# EAGLE design efikaVFD (EAGLE 5.11)
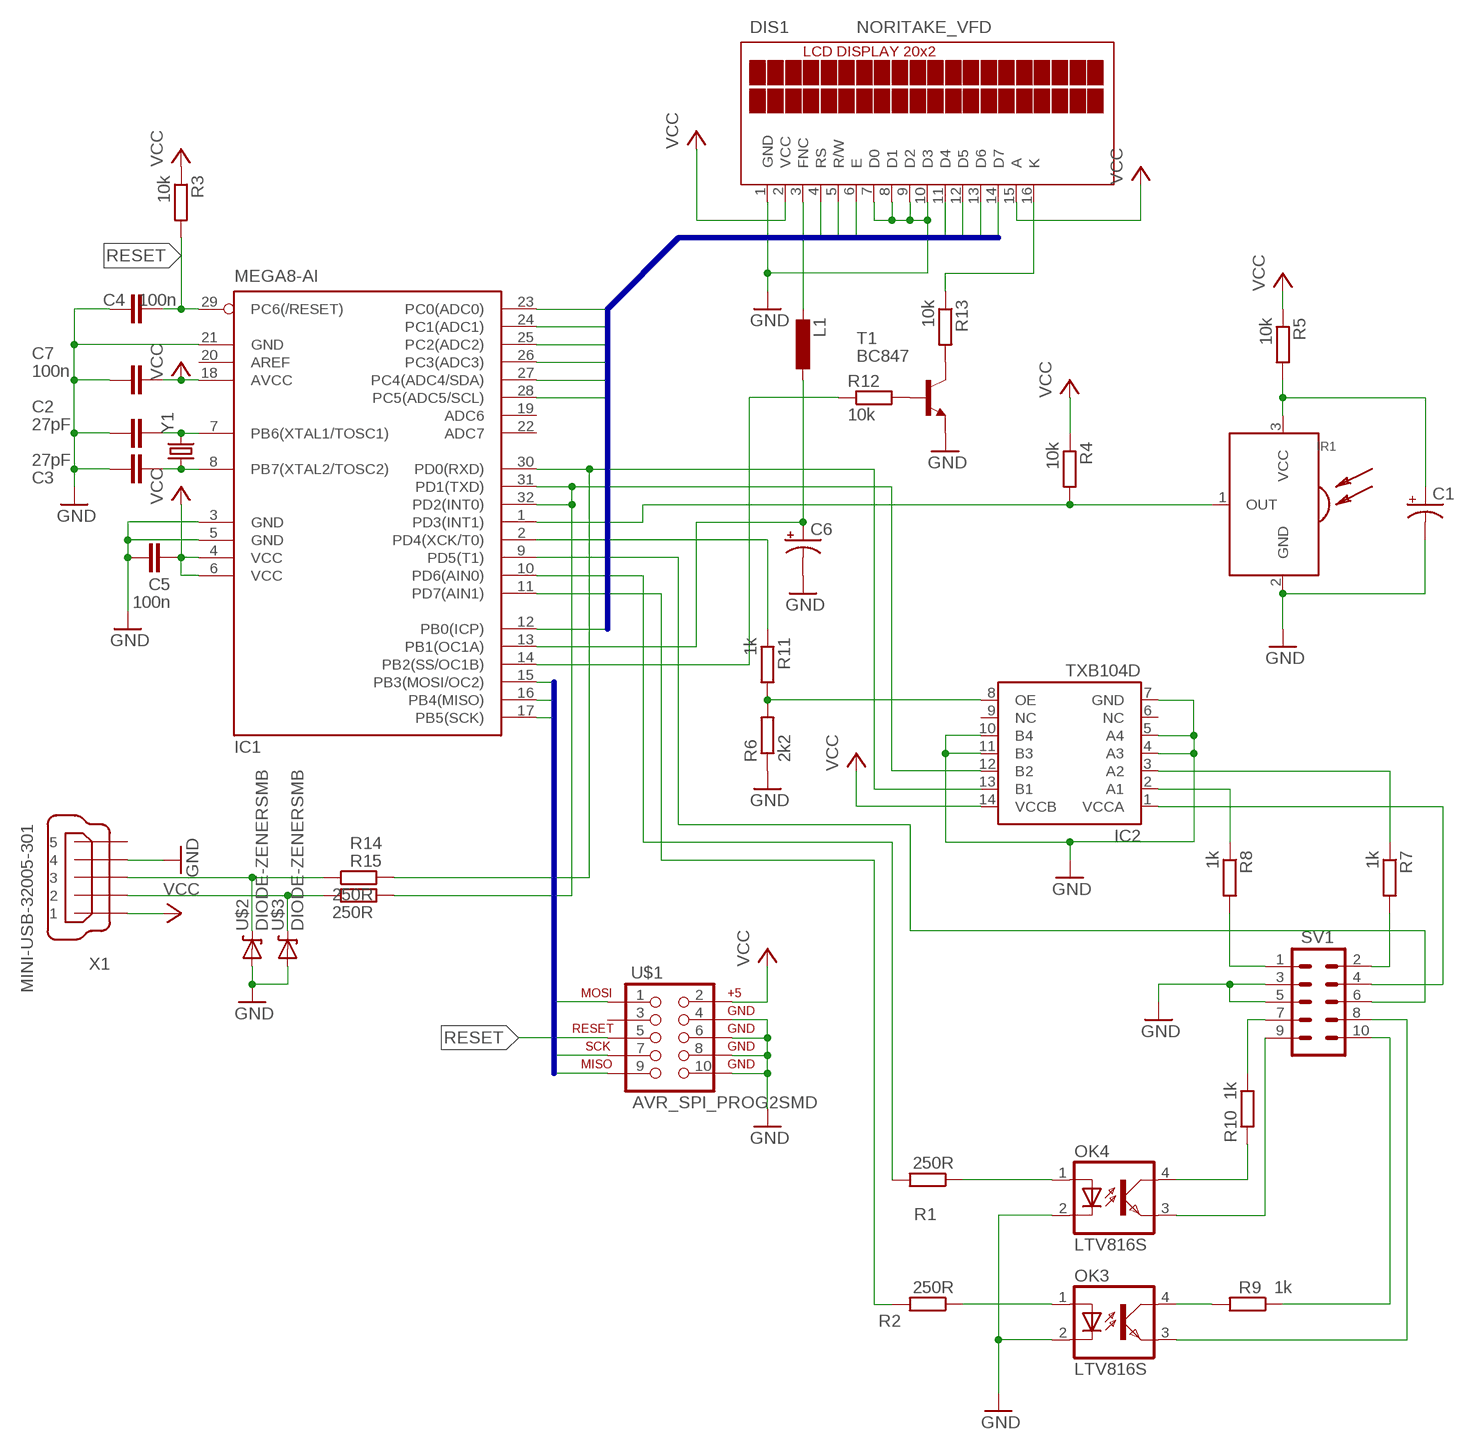
[diagram p0: schematic, sheet 1]

## Parts
C1  CAP_POLPTH2  [CPOL-RADIAL-10UF-25V]
C2  27pF  C-EUC1206  [C1206]
C3  27pF  C-EUC1206  [C1206]
C4  100n  C-EUC1206  [C1206]
C5  100n  C-EUC1206  [C1206]
C6  CAP_POLPTH2  [CPOL-RADIAL-10UF-25V]
C7  100n  C-EUC1206  [C1206]
DIS1  NORITAKE_VFD  [TUXGR_20X2_BOTTOM]
IC1  MEGA8-AI  [TQFP32-08]
IC2  TXB104D  [SOIC(D)-14]
IR1  SFH5110  [SFH511*]
L1  L-EU0204/5  [0204/5]
OK3  LTV816S  [SO04]
OK4  LTV816S  [SO04]
R1  250R  R-EU_M1206  [M1206]
R2  250R  R-EU_M1206  [M1206]
R3  10k  R-EU_M1206  [M1206]
R4  10k  R-EU_M1206  [M1206]
R5  10k  R-EU_M1206  [M1206]
R6  2k2  R-EU_M1206  [M1206]
R7  1k  R-EU_M1206  [M1206]
R8  1k  R-EU_M1206  [M1206]
R9  1k  R-EU_M1206  [M1206]
R10  1k  R-EU_M1206  [M1206]
R11  1k  R-EU_M1206  [M1206]
R12  10k  R-EU_M1206  [M1206]
R13  10k  R-EU_M1206  [M1206]
R14  250R  R-EU_M1206  [M1206]
R15  250R  R-EU_M1206  [M1206]
SV1  M05X2SHD_SMD  [2X5-SHROUDED_SMD]
T1  BC847  [SOT23]
U$1  AVR_SPI_PROG2SMD  [2X5-SHROUDED_SMD]
U$2  DIODE-ZENERSMB  [SMB-DIODE]
U$3  DIODE-ZENERSMB  [SMB-DIODE]
X1  MINI-USB-32005-301  [32005-301]
Y1  CRYSTAL10.5X4.8  [CRYSTAL-SMD-10.5X4.8-2PIN]

## Nets
$N200: C1.1(+) IR1.3(VCC) R5.2
D4: DIS1.11(D4) IC1.25(PC2(ADC2))
D5: DIS1.12(D5) IC1.26(PC3(ADC3))
D6: DIS1.13(D6) IC1.27(PC4(ADC4/SDA))
D7: DIS1.14(D7) IC1.28(PC5(ADC5/SCL))
E: DIS1.6(E) IC1.23(PC0(ADC0))
GND: C1.2(-) C2.1 C3.1 C4.1 C5.1 C6.2(-) C7.1 DIS1.1(GND) DIS1.7(D0) DIS1.8(D1) DIS1.9(D2) DIS1.10(D3) IC1.3(GND) IC1.5(GND) IC1.21(GND) IC2.4(A3) IC2.5(A4) IC2.7(GND) IC2.10(B4) IC2.11(B3) IR1.2(GND) OK3.2(C) OK4.2(C) R6.1 SV1.3 SV1.5 T1.2(E) U$1.4 U$1.6 U$1.8 U$1.10 U$2.A U$3.A X1.4
MISO: IC1.16(PB4(MISO)) U$1.9
MOSI: IC1.15(PB3(MOSI/OC2)) U$1.1
N$1: C2.2 IC1.7(PB6(XTAL1/TOSC1)) Y1.P$2
N$2: C3.2 IC1.8(PB7(XTAL2/TOSC2)) Y1.P$1
N$3: OK4.3(EMIT) SV1.9
N$4: OK3.3(EMIT) SV1.8
N$5: IC1.1(PD3(INT1)) IR1.1(OUT) R4.2
N$6: OK3.1(A) R2.1
N$7: OK4.4(COL) R10.2
N$8: IC1.10(PD6(AIN0)) R1.2
N$9: IC1.11(PD7(AIN1)) R2.2
N$10: R9.1 SV1.10
N$11: OK4.1(A) R1.1
N$12: IC2.2(A1) R8.1
N$13: IC2.3(A2) R7.1
N$14: IC2.1(VCCA) SV1.4
N$15: IC1.2(PD4(XCK/T0)) R11.1
N$16: IC1.9(PD5(T1)) SV1.6
N$17: R7.2 SV1.2
N$18: R8.2 SV1.1
N$19: OK3.4(COL) R9.2
N$20: R10.1 SV1.7
N$21: IC2.8(OE) R6.2 R11.2
N$22: R12.2 T1.1(B)
N$23: R13.2 T1.3(C)
N$24: C6.1(+) IC1.13(PB1(OC1A)) L1.1
N$25: DIS1.3(FNC) L1.2
N$26: IC1.14(PB2(SS/OC1B)) R12.1
N$27: DIS1.16(K) R13.1
N$28: R15.1 U$3.C X1.2
N$29: R14.1 U$2.C X1.3
RESET: C4.2 IC1.29(PC6(/RESET)) R3.2 U$1.5
RS: DIS1.4(RS) IC1.12(PB0(ICP))
RW: DIS1.5(R/W) IC1.24(PC1(ADC1))
RXD: IC1.30(PD0(RXD)) IC2.13(B1) R14.2
SCK: IC1.17(PB5(SCK)) U$1.7
TXD: IC1.31(PD1(TXD)) IC1.32(PD2(INT0)) IC2.12(B2) R15.2
VCC: C5.2 C7.2 DIS1.2(VCC) DIS1.15(A) IC1.4(VCC) IC1.6(VCC) IC1.18(AVCC) IC2.14(VCCB) R3.1 R4.1 R5.1 U$1.2 X1.1
Unconnected: IC1.19(ADC6) IC1.20(AREF) IC1.22(ADC7) IC2.6(NC) IC2.9(NC) U$1.3 X1.5

## Buses
D[0..7],FNC,RS,RW,E
MOSI,SCK,MISO

## Library data of the parts
C1 C6 = SparkFun:CAP_POL: Capacitor Polarized These are standard SMD and PTH capacitors. Normally 10uF, 47uF, and 100uF in electrolytic and tantalum varieties. Always verify the external diameter of the through hole cap, it varies with capacity, voltage, and manufacturer. The EIA devices should be standard.
C2-C5 C7 = rcl:C-EU: CAPACITOR, European symbol
DIS1 = Various:NORITAKE_VFD: Tuxgraphics LCD display 20x2 characters reflective, without background light Source: tuxgr_20x2.pdf; OC_FARNELL: unknown; OC_NEWARK: unknown
IC1 = atmel:MEGA8: MICROCONTROLLER 8 Kbytes FLASH, 1 kbytes SRAM, 512 bytes EEPROM, USART, 6-channel 10 bit ADC, 2-channel 8 bit ADC Pin compatible with Atmega48, ATMega88, ATMega168 Source: avr.lbr; MPN: ATMEGA8-16AU; OC_FARNELL: 9171371; OC_NEWARK: 73M8863
IC2 = ti_txb0104:TXB104
IR1 = svo:SFH511*: SFH 5110 and SFH 5111 are IR receivers to detect light from infrared remote control systems. The IC includes photodiode, preamplifier, automatic gain control, bandpass and demodulator. The black-colored package is designed as daylight- cutoff filter.
L1 = rcl:L-EU: INDUCTOR, European symbol
OK3 OK4 = Various:LTV816: OPTO COUPLER Source: LITEON, LTV816.pdf; OC_FARNELL: unknown; OC_NEWARK: unknown
R1-R15 = resistor:R-EU_: RESISTOR, European symbol
SV1 = SparkFun:M05X2: Header 5x2 Standard 10-pin dual row 0.1" header. Commonly used with AVR-ISP. Use with Spark Fun Electronics SKU: PRT-00778
T1 = transistor:BC847: NPN TRANSISTOR
U$1 = SparkFun:AVR_SPI_PROG2: AVR ICSP Header This is the standard AVR In Circuit Serial Programming header. Minimal, but includes pin one indicator. Works with standard Olimex programmers. Also look for the 6-pin reduced version. Spark Fun Electronics SKU: PRT-00778
U$2 U$3 = SparkFun:DIODE-ZENER: Zener Diode Production Part - 8199 3.4V Zener Voltage
X1 = con-cypressindustries:MINI-USB-: MINI USB-B Conector Source: www.cypressindustries.com; OC_FARNELL: unknown; OC_NEWARK: unknown
Y1 = SparkFun:CRYSTAL: Crystals Various standard crystals. Proven footprints. Spark Fun Electronics SKU : COM-00534

## Board
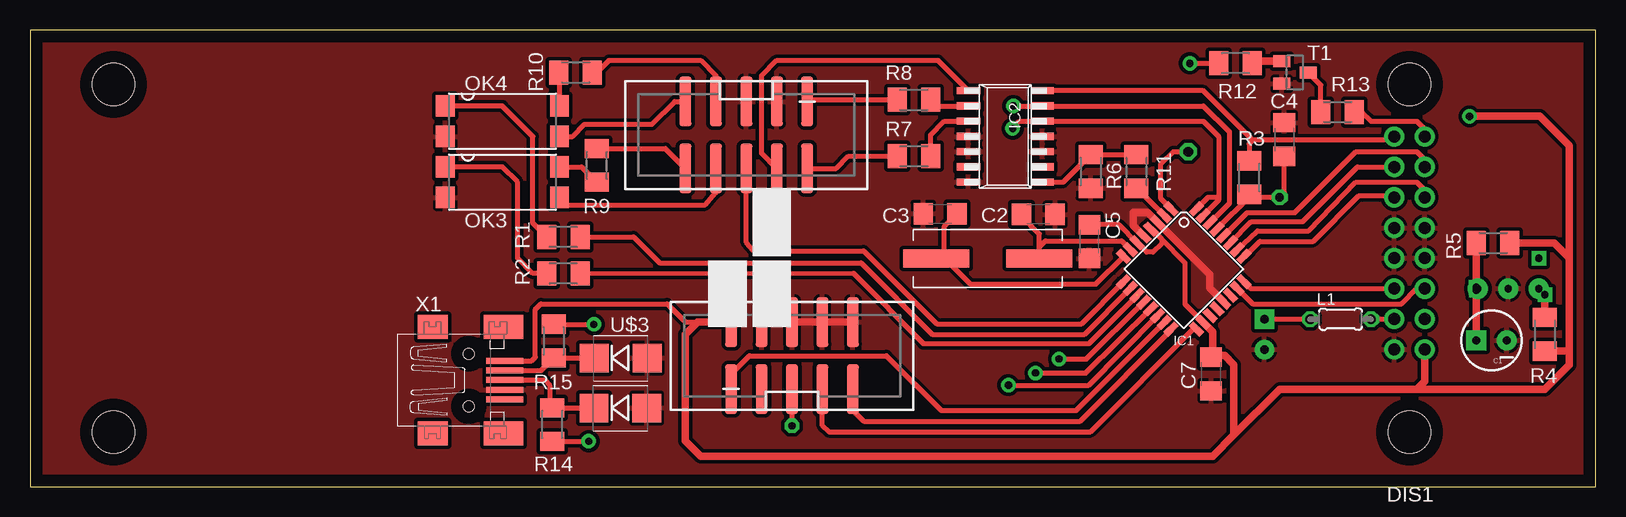
[diagram p1: board, top side]
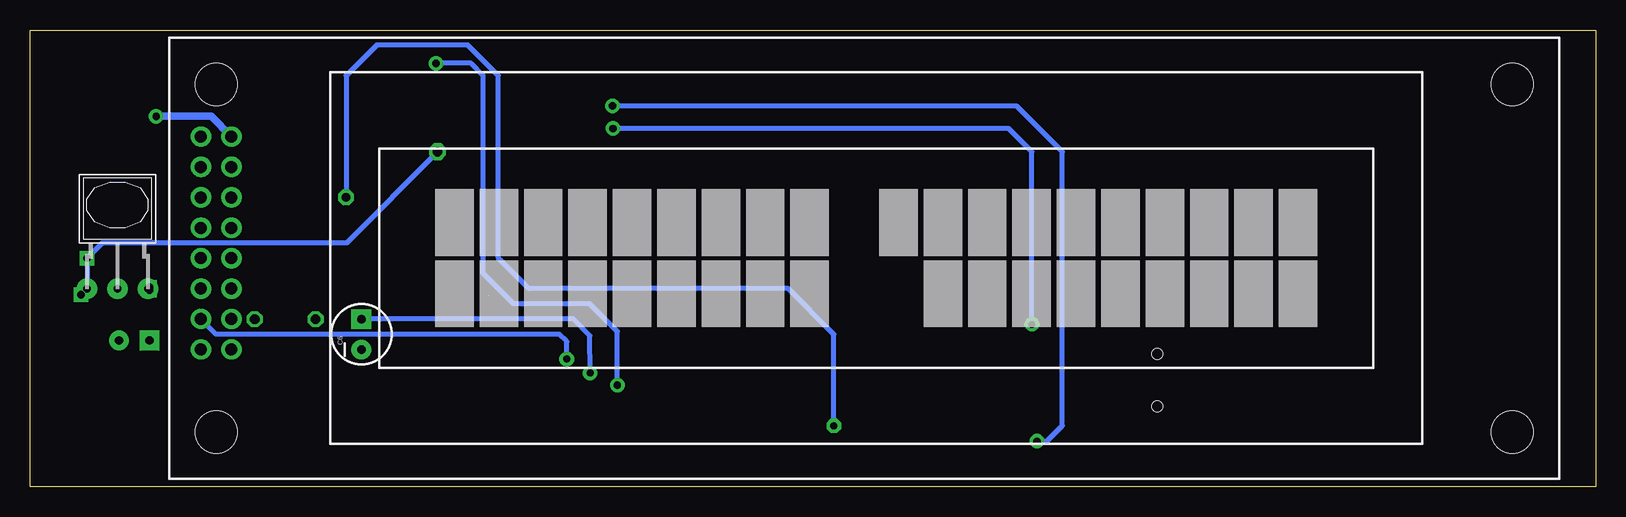
[diagram p2: board, bottom side, seen from below]

Size 130.48 x 38.09 mm. Coordinates in mm from the lower left corner, seen from the top.
Outline: 0,0 130.48,0 130.48,38.09 0,38.09 0,0
Copper layers (1*16): Top 0.035mm / dielectric 1.5mm / Bottom 0.035mm
Design rules "default *": minimum track width 10mil, minimum drill 24mil, track to track 8mil, track to pad 8mil, pad to pad 8mil, via to via 8mil, smd to smd 8mil, copper to edge 40mil, drill to drill 8mil, minimum pad ring 10mil, minimum via ring 12mil, stop-mask expansion 4mil, vias tented up to drill 0mil, thermal gap 10mil

### Footprints (pad centres in the part's own frame; a part is rotated, then mirrored left to right if it is on the bottom)
CPOL-RADIAL-10UF-25V = drill 0.7 pad 1.651 square: 1 1.27,0 | drill 0.7 pad 1.651 round: 2 -1.27,0
C1206 = smd 1.6 x 1.8: 1 -1.4,0; 2 1.4,0
TUXGR_20X2_BOTTOM = drill 1 pad 1.676 round: 1 52.73,-7.62; 2 55.27,-7.62; 3 52.73,-5.08; 4 55.27,-5.08; 5 52.73,-2.54; 6 55.27,-2.54; 7 52.73,0; 8 55.27,0; 9 52.73,2.54; 10 55.27,2.54; 11 52.73,5.08; 12 55.27,5.08; 13 52.73,7.62; 14 55.27,7.62; 15 52.73,10.16; 16 55.27,10.16 | hole 3.5: 54,-14.5; -54,-14.5; 54,14.5; -54,14.5
TQFP32-08 = smd 1.27 x 0.559: 1 -4.293,2.8; 2 -4.293,2; 3 -4.293,1.2; 4 -4.293,0.4; 5 -4.293,-0.4; 6 -4.293,-1.2; 7 -4.293,-2; 8 -4.293,-2.8; 17 4.293,-2.8; 18 4.293,-2; 19 4.293,-1.2; 20 4.293,-0.4; 21 4.293,0.4; 22 4.293,1.2; 23 4.293,2; 24 4.293,2.8 | smd 0.559 x 1.27: 9 -2.8,-4.293; 10 -2,-4.293; 11 -1.2,-4.293; 12 -0.4,-4.293; 13 0.4,-4.293; 14 1.2,-4.293; 15 2,-4.293; 16 2.8,-4.293; 25 2.8,4.293; 26 2,4.293; 27 1.2,4.293; 28 0.4,4.293; 29 -0.4,4.293; 30 -1.2,4.293; 31 -2,4.293; 32 -2.8,4.293
SOIC(D)-14 = smd 0.61 x 1.93: 1 -3.81,-3.076; 2 -2.54,-3.076; 3 -1.27,-3.076; 4 0,-3.076; 5 1.27,-3.076; 6 2.54,-3.076; 7 3.81,-3.076; 8 3.81,3.076; 9 2.54,3.076; 10 1.27,3.076; 11 0,3.076; 12 -1.27,3.076; 13 -2.54,3.076; 14 -3.81,3.076
SFH511* = drill 0.61 pad 1.676 round: 1 -2.54,0; 2 0,0; 3 2.54,0
0204/5 = drill 0.813 octagon: 1 -2.54,0; 2 2.54,0
SO04 = smd 1.78 x 1.55: 1 -1.27,-3.5; 2 1.27,-3.5; 3 1.27,6.04; 4 -1.27,6.04
M1206 = smd 1.6 x 2: 1 -1.4,0; 2 1.4,0
2X5-SHROUDED_SMD = smd 4.15 x 1: 1 -2.794,5.08; 2 2.794,5.08; 3 -2.794,2.54; 4 2.794,2.54; 5 -2.794,0; 6 2.794,0; 7 -2.794,-2.54; 8 2.794,-2.54; 9 -2.794,-5.08; 10 2.794,-5.08
SOT23 = smd 1 x 1.4: 1 -0.95,-1.1; 2 0.95,-1.1; 3 0,1.1
SMB-DIODE = smd 2.4 x 2.4: A 2.2,0; C -2.2,0
32005-301 = smd 3.1 x 0.5: 1 3,1.6; 2 3,0.8; 3 3,0; 4 3,-0.8; 5 3,-1.6 | smd 2.5 x 2: M1 -3,-4.45; M2 -3,4.45 | smd 3.3 x 2: M3 2.9,4.45; M4 2.9,-4.45 | hole 0.9: 0,2.2; 0,-2.2
CRYSTAL-SMD-10.5X4.8-2PIN = smd 5.5 x 1.5: P$1 -4.3,0; P$2 4.3,0

### Placement (x,y rotation side)
C1  121.79,12.19 180 top
C2  84.02,22.71 180 top
C3  75.84,22.76 0 top
C4  104.52,28.96 270 top
C5  88.29,20.45 90 top
C6  102.87,12.7 90 bottom
C7  98.43,9.4 90 top
DIS1  60.96,19.05 0 top
IC1  96.15,18.15 315 top
IC2  81.28,29.21 270 top
IR1  123.19,16.51 0 bottom
L1  109.22,13.97 0 top
OK3  38.1,25.4 270 top
OK4  38.1,30.48 270 top
R1  44.45,20.83 0 top
R2  44.45,17.78 0 top
R3  101.6,25.78 270 top
R4  126.24,12.7 90 top
R5  121.92,20.32 180 top
R6  88.39,26.29 90 top
R7  73.66,27.56 180 top
R8  73.66,32.26 180 top
R9  47.24,26.8 270 top
R10  45.47,34.54 180 top
R11  92.2,26.29 90 top
R12  100.46,35.31 0 top
R13  108.97,31.24 180 top
R14  43.54,5.18 270 top
R15  43.64,12.14 90 top
SV1  59.69,29.34 270 top
T1  105.41,34.54 270 top
U$1  63.5,10.92 90 top
U$2  49.2,6.55 0 top
U$3  49.23,10.72 0 top
X1  36.55,8.89 0 top
Y1  79.81,19.02 0 top

### Tracks (layer width: path | path; a pad name or v marks a point on that pad's centre or on a via)
$N200  (via drill 0.6)
  Top 0.61: C1.1 v120.52,16.38 IR1.3 v120.52,16.64 R5.2
D4
  Top 0.406: IC1.25 101.25,19.21 102.49,20.45 106.93,20.45 110.74,24.26 113.56,24.26 DIS1.11
D5
  Top 0.406: DIS1.12 116.23,24.74 115.57,25.4 110.49,25.4 106.55,21.34 102.29,21.34 IC1.26
D6
  Top 0.406: IC1.27 101.79,22.1 106.05,22.1 110.62,26.67 DIS1.13
D7
  Top 0.406: IC1.28 101.42,22.86 105.41,22.86 110.49,27.94 115.57,27.94 116.23,27.28 DIS1.14
E
  Top 0.406: DIS1.6 115.57,16.51 114.3,15.24 101.89,15.24 IC1.23
GND
  Top 0.61: U$1.10 U$1.8 U$1.6 | U$1.6 63.25,13.97 | U$1.4 U$1.6 | IC1.21 98.3,16.57 98.3,17.7 IC1.3 93.14,22.86 91.95,22.86 91.95,21.79 IC1.5
  pour Top (isolate 0.305): -1.27,39.37 -1.27,0 130.81,0 130.81,39.37
MISO
  Top 0.406: IC1.16 95.09,13.05 87.5,5.46 69.47,5.46 68.58,6.35 U$1.9
MOSI
  Top 0.406: U$1.1 58.42,9.4 59.94,10.92 71.37,10.92 75.95,6.35 87.17,6.35 IC1.15
N$1
  Top 0.406: C2.2 82.55,22.63 84.11,21.08 84.11,20 | 82.55,19.05 82.58,19.02 Y1.P$2 84.11,20 | IC1.7 90.97,20.5 84.61,20.5 84.11,20
N$2
  Top 0.406: IC1.8 88.82,16.89 78.36,16.89 76.2,19.05 | Y1.P$1 76.2,19.05 | C3.2 76.2,21.71 76.2,19.05
N$3
  Top 0.406: SV1.9 53.72,32.13 51.82,30.23 46.23,30.23 45.21,29.21 OK4.3
N$4
  Top 0.406: SV1.8 57.15,24.51 56.26,23.49 44.78,23.49 OK3.3
N$5  (via drill 0.6, 0.8 pad 0.61)
  Top 0.406: v96.52,27.94 95.25,27.94 94.23,26.92 94.23,24.03 IC1.1
  Top 0.61: IR1.1 v126.24,16 R4.2
  Bottom 0.406: v96.52,27.94 100.33,24.13 100.33,24.05 104.06,20.32 124.46,20.32 v125.73,19.05 IR1.1
N$6
  Top 0.406: OK3.1 39.37,26.67 40.64,25.4 40.64,19.05 41.91,17.78 R2.1
N$7
  Top 0.406: OK4.4 44.14,34.47
  Top 0.61: 44.14,34.47 R10.2
N$8  (1 unrouted)
  Top 0.406: R1.2 50.29,20.83 52.48,18.67 69.27,18.67 75.18,12.7 87.88,12.7 91.7,16.51
N$9  (1 unrouted)
  Top 0.406: R2.2 68.61,17.8 74.42,11.94 88.27,11.94 92.26,15.94
N$10
  Top 0.406: 54.48,26.67 SV1.10 52.96,28.2 R9.1
N$11
  Top 0.406: R1.1 41.91,21.97 41.91,29.21 39.37,31.75 OK4.1
N$12
  Top 0.406: IC2.2 75.57,31.75 R8.1
N$13
  Top 0.406: IC2.3 76.2,30.48 75.06,29.34 75.06,27.94 R7.1
N$14
  Top 0.406: 77.72,33.02 IC2.1 75.66,35.56 62.23,35.56 60.96,34.29 60.96,27.81 SV1.4
N$15
  Top 0.406: 94.49,22.6 IC1.2 92.24,24.89 R11.1
N$16
  Top 0.406: SV1.6 59.69,20.37 60.33,19.66 69.47,19.66 75.56,13.59 87.62,13.59 IC1.9
N$17
  Top 0.406: SV1.2 67.18,26.54 68.2,27.56 R7.2
N$18
  Top 0.406: R8.2 64.9,32.26 SV1.1
N$19
  Top 0.406: R9.2 45.97,26.67 OK3.4
N$20
  Top 0.406: SV1.7 57.15,34.29 55.88,35.56 48.26,35.56 47.24,34.54 R10.1
N$21
  Top 0.406: IC2.8 86.1,25.4 R6.2 R11.2
N$22
  Top 0.61: T1.1 102.05,35.49 R12.2
N$23
  Top 0.406: R13.2 107.57,33.49 T1.3
N$24  (via drill 0.6)
  Top 0.406: C6.1 L1.1 | IC1.13 87.99,9.47 v83.8,9.47
  Bottom 0.406: v83.8,9.47 83.82,12.6 85.17,13.97 C6.1
N$25
  Top 0.406: L1.2 DIS1.3
N$26  (via drill 0.6, 0.6 pad 0.61)
  Top 0.406: v96.65,35.31 R12.1 | IC1.14 93.97,14.27 93.97,14.22 93.95,14.22 88.21,8.46 v81.53,8.46
  Bottom 0.406: v81.53,8.46 81.53,12.95 83.82,15.24 90.17,15.24 92.71,17.78 92.71,34.29 93.73,35.31 v96.65,35.31
N$27
  Top 0.406: DIS1.16 116.23,29.82 115.57,30.48 111.76,30.48 111,31.24 R13.1
N$28
  Top 0.406: X1.2 42.59,9.69 R15.1 | 43.66,10.72 U$3.C
  Top 0.61: R15.1 43.66,10.72
N$29
  Top 0.406: X1.3 42.88,8.89 43.31,8.46 43.31,6.81 | 43.38,6.55 U$2.C
  Top 0.61: 43.38,6.55 43.18,6.35 43.3,6.35 R14.1 43.31,6.81
RESET  (via drill 0.6, 0.7 pad 0.41)
  Top 0.406: IC1.29 101.6,24.17 R3.2 101.85,24.13 v104.14,24.13 104.52,24.51 C4.2 | v63.5,5.08 U$1.5
  Bottom 0.406: v63.5,5.08 63.5,12.7 67.31,16.51 88.9,16.51 91.44,19.05 91.44,34.29 93.98,36.83 101.6,36.83 104.14,34.29 v104.14,24.13
RS  (via drill 0.6)
  Top 0.406: 92.83,15.36 IC1.12 92.79,15.4 88.04,10.64 v85.75,10.64
  Bottom 0.406: v85.75,10.64 85.75,12.09 86.36,12.7 114.96,12.7 DIS1.4
RW
  Top 0.406: DIS1.5 101.75,16.51 IC1.24
RXD  (via drill 0.6)
  Top 0.406: IC1.30 98.36,22.04 99.95,23.62 99.95,29.59 97.79,31.75 IC2.13 v81.94,31.75 82.25,31.75 | v46.56,3.78 R14.2
  Bottom 0.406: v81.94,31.75 48.26,31.75 44.45,27.94 44.45,5.08 45.72,3.81 46.53,3.81 v46.56,3.78
SCK
  Top 0.406: IC1.17 96.96,13.14 88.39,4.57 66.55,4.57 66.04,5.08 U$1.7
TXD  (via drill 0.6)
  Top 0.406: IC1.31 99.06,23.89 99.06,24.13 | 99.06,24.13 99.06,29.21 97.79,30.48 IC2.12 82.45,30.48 v81.89,29.87 | IC1.32 98.17,24.13 99.06,24.13 | v46.99,13.54 R15.2
  Bottom 0.406: v81.89,29.87 48.92,29.87 46.99,27.94 v46.99,13.54
VCC  (via drill 0.6)
  Top 0.406: IC1.18 97.8,13.7 | R4.1 126.24,11.43 | R5.1 123.19,20.45 | IC1.4 93.47,21.47 94.3,20.64 | 94.3,20.64 96.27,18.67 96.27,15.2 98.15,13.32 | C5.2 90.76,21.85 IC1.6 93.05,19.56 93.6,19.56 94.3,20.26 94.3,20.64 | 55.63,13.72 54.61,13.72 53.09,15.24 42.57,15.24 42.11,14.78 42.11,10.79 41.81,10.49 X1.1 | IC2.14 97.79,33.02 101.91,28.91 | 101.91,28.91 113.38,28.91 DIS1.15 | 101.91,28.91 101.6,28.6 R3.1
  Top 0.61: 126.11,11.43 R4.1 128.14,11.3 128.27,11.43 | IC1.18 98.15,13.32 98.55,12.92 98.55,10.92 | U$1.2 55.63,13.72 54.61,12.7 54.61,3.81 55.88,2.54 98.56,2.54 100.33,4.31 | 100.33,4.31 104.14,8.12 115.57,8.12 | 98.55,10.92 C7.2 | 98.55,10.92 99.56,10.92 100.33,10.16 100.33,4.31 | R5.1 127,20.32 128.27,19.05 | 128.27,11.43 128.27,10.16 126.24,8.12 115.57,8.12 | 128.27,11.43 128.27,19.05 | DIS1.2 116.23,8.78 115.57,8.12 | 128.27,19.05 128.27,28.45 125.83,30.89 v119.96,30.89 | R3.1 101.6,27.63
  Top 0.813: 126.11,11.43 125.73,11.43
  Bottom 0.406: DIS1.2 116.23,10.82
  Bottom 0.61: DIS1.15 115.37,30.89 v119.96,30.89